# Altium project Omarichet_EPS - Copy.PrjPcb (part 2 of 2)

## Sheet Sheet2.SchDoc
size 350 x 299 mm; SheetNumber: 2; SheetTotal: 3
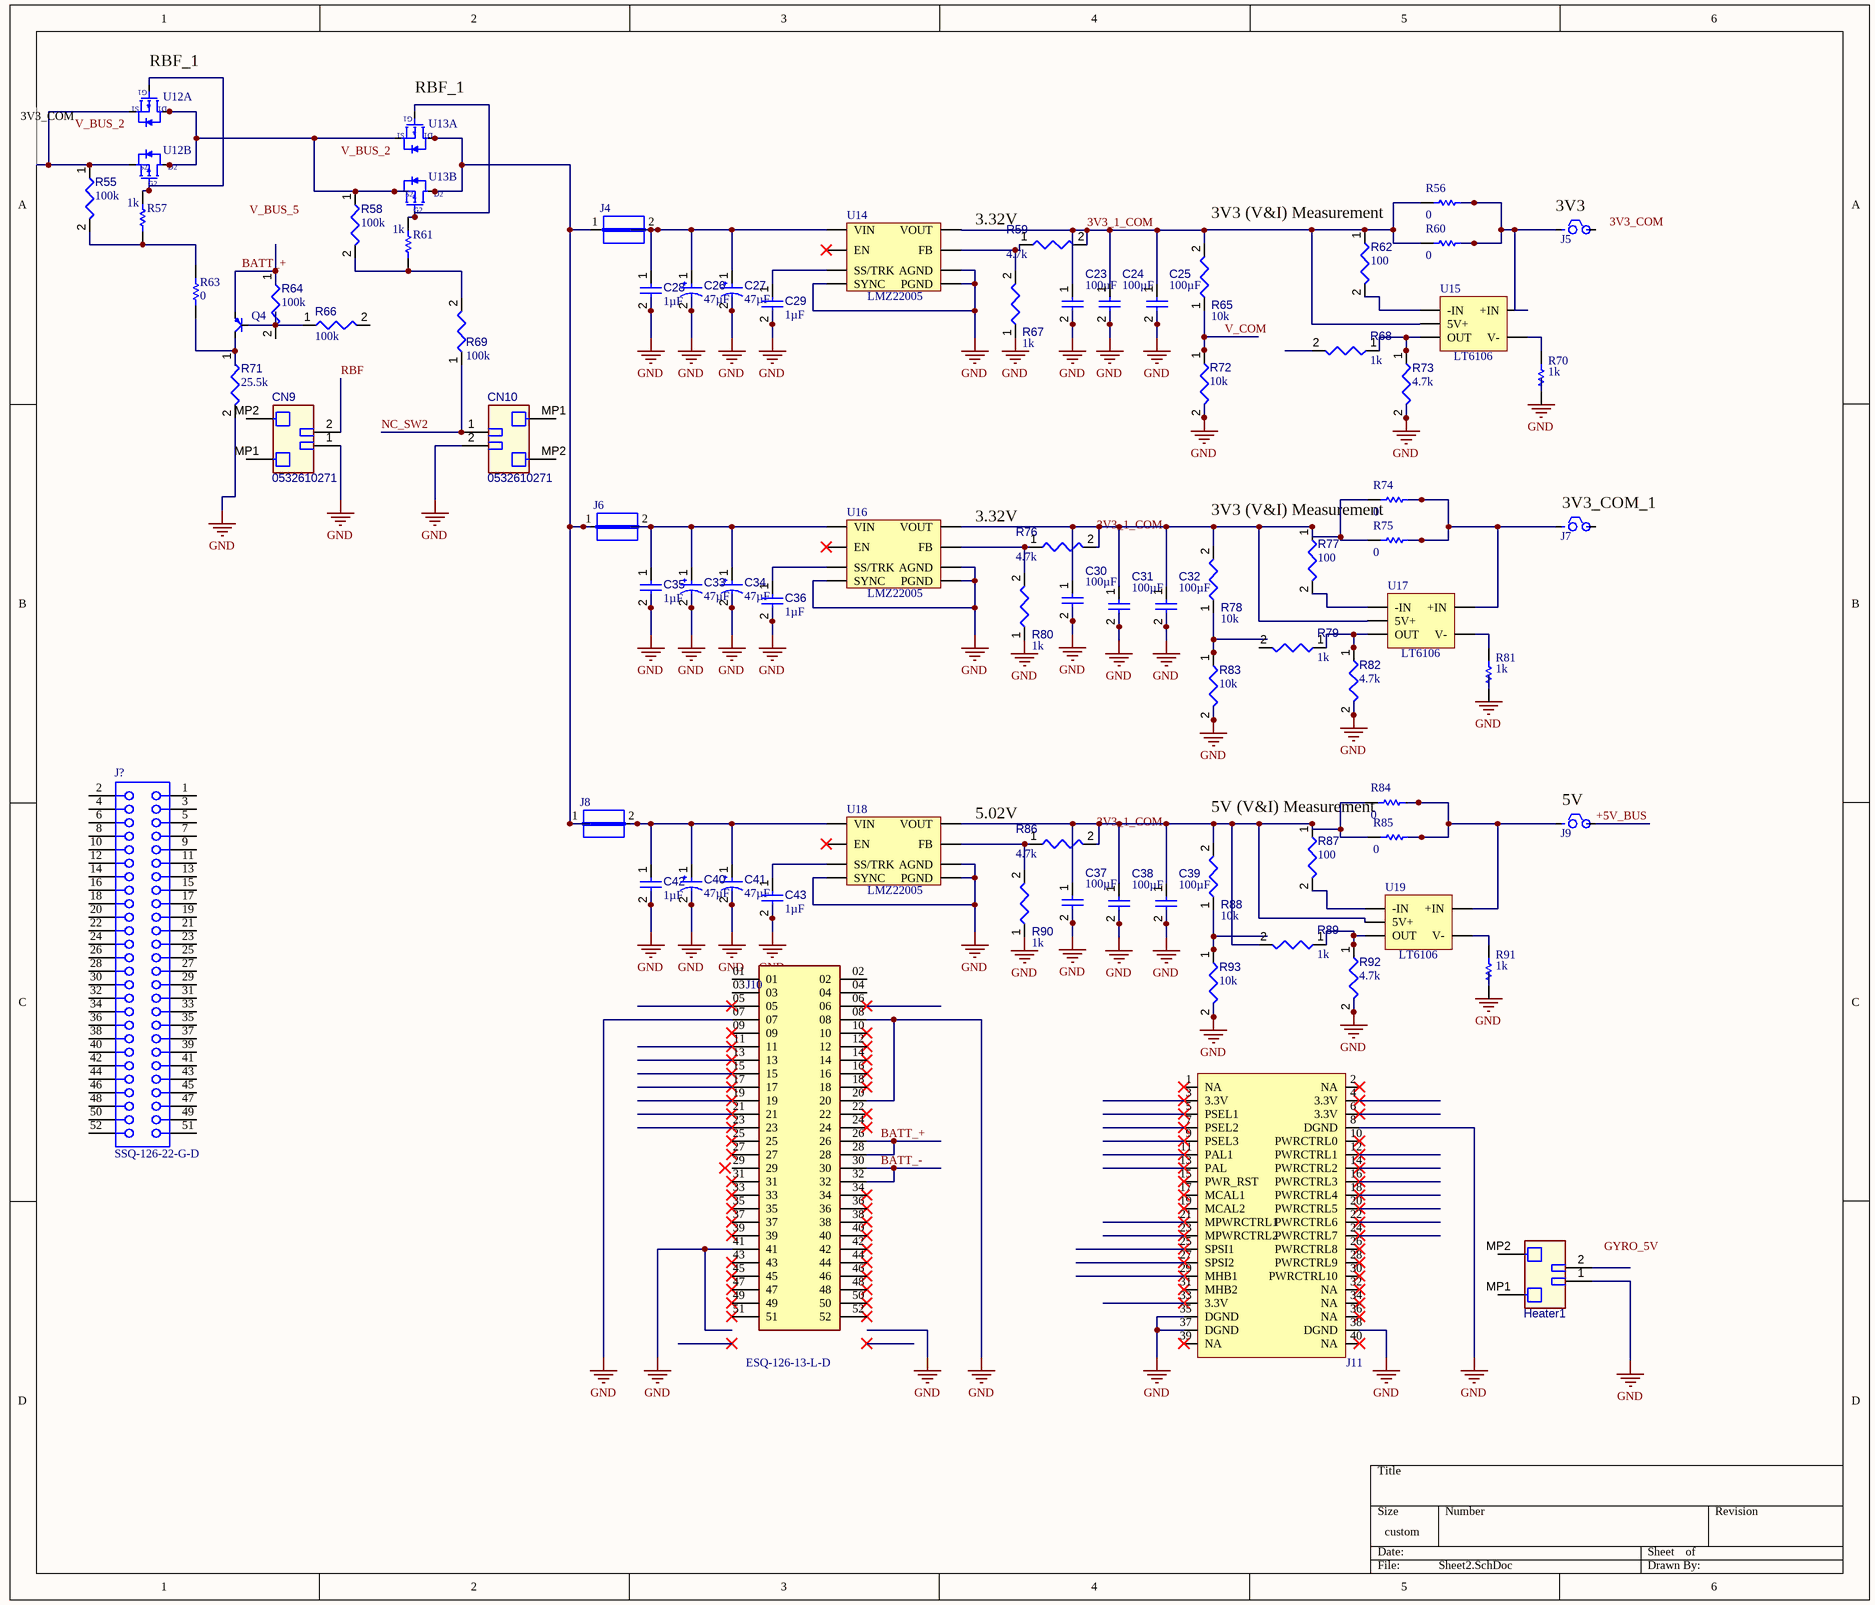
[diagram p1: Sheet2.SchDoc]

### Parts
(Parts that share a designator on the sheet are numbered #1, #2 ... from top to bottom, then left to right.)
C23  value 100µF  [CAPC0805(2012)145_L]  (hidden comment: Capacitor 100µF +/-20% 6.3V 0805)
C24  value 100µF  [CAPC0805(2012)145_L]  (hidden comment: Capacitor 100µF +/-20% 6.3V 0805)
C25  value 100µF  [CAPC3216X190X55LL30T25]  (hidden comment: Capacitor 100 uF +/- 20% 6.3 V 1206)
C26  value 47µF  [CAPPR55-250-1120X630X1220]  (hidden comment: ECA-1HM470)
C27  value 47µF  [CAPPR55-250-1120X630X1220]  (hidden comment: ECA-1HM470)
C28  value 1µF  [CAPC0603(1608)100_L]  (hidden comment: Capacitor 1µF +/-40% 50V 0603)
C29  value 1µF  [CAPC1608X94X35NL15T15]  (hidden comment: Capacitor 1 uF +/- 10% 16 V 0603)
C30  value 100µF  [CAPC0805(2012)145_L]  (hidden comment: Capacitor 100µF +/-20% 6.3V 0805)
C31  value 100µF  [CAPC0805(2012)145_L]  (hidden comment: Capacitor 100µF +/-20% 6.3V 0805)
C32  value 100µF  [CAPC3216X190X55LL30T25]  (hidden comment: Capacitor 100 uF +/- 20% 6.3 V 1206)
C33  value 47µF  [CAPPR55-250-1120X630X1220]  (hidden comment: ECA-1HM470)
C34  value 47µF  [CAPPR55-250-1120X630X1220]  (hidden comment: ECA-1HM470)
C35  value 1µF  [CAPC0603(1608)100_L]  (hidden comment: Capacitor 1µF +/-40% 50V 0603)
C36  value 1µF  [CAPC1608X94X35NL15T15]  (hidden comment: Capacitor 1 uF +/- 10% 16 V 0603)
C37  value 100µF  [CAPC0805(2012)145_L]  (hidden comment: Capacitor 100µF +/-20% 6.3V 0805)
C38  value 100µF  [CAPC0805(2012)145_L]  (hidden comment: Capacitor 100µF +/-20% 6.3V 0805)
C39  value 100µF  [CAPC3216X190X55LL30T25]  (hidden comment: Capacitor 100 uF +/- 20% 6.3 V 1206)
C40  value 47µF  [CAPPR55-250-1120X630X1220]  (hidden comment: ECA-1HM470)
C41  value 47µF  [CAPPR55-250-1120X630X1220]  (hidden comment: ECA-1HM470)
C42  value 1µF  [CAPC0603(1608)100_L]  (hidden comment: Capacitor 1µF +/-40% 50V 0603)
C43  value 1µF  [CAPC1608X94X35NL15T15]  (hidden comment: Capacitor 1 uF +/- 10% 16 V 0603)
CN9  0532610271  [MOLX-532610271_V]
CN10  0532610271  [MOLX-532610271_V]
Heater1  0532610271  [MOLX-532610271_V]  (value not drawn)
J4  JUMPER  [JUMPER]  (value not drawn)
J5  ESW-102-13-L-S  [ESW-102-13-L-S]  (value not drawn)
J6  JUMPER  [JUMPER]  (value not drawn)
J7  ESW-102-13-L-S  [ESW-102-13-L-S]  (value not drawn)
J8  JUMPER  [JUMPER]  (value not drawn)
J9  ESW-102-13-L-S  [ESW-102-13-L-S]  (value not drawn)
J10  ESQ-126-13-L-D  [SAMTEC_ESQ-126-13-L-D]
J11  ESQ-120-13-L-D  [SAMTEC_ESQ-126-13-L-D]  (value not drawn)
J?#1  SSQ-126-22-G-D  [SAMTEC_SSQ-126-X-G-D]
Q4  CMPT404A TR  [CMPT404A TR]  (value not drawn)
R55  value 100k  [RESC1608X55X25ML10T15]  (hidden comment: Resistor 100k +/-1% 0603 100 mW)
R56  value 0  [RESC2013X50X35ML15T15]  (hidden comment: Resistor 0R +/- 1% 0805 125 mW)
R57  value 1k  [RESC3116X70X50ML13T20]  (hidden comment: Resistor 1k +/-1% 1206 250 mW)
R58  value 100k  [RESC1608X55X25ML10T15]  (hidden comment: Resistor 100k +/-1% 0603 100 mW)
R59  value 4.7k  [RESC1005X40X25ML05T05]  (hidden comment: Resistor 4k7 +/-1% 0402 63 mW)
R60  value 0  [RESC2013X50X35ML15T15]  (hidden comment: Resistor 0R +/- 1% 0805 125 mW)
R61  value 1k  [RESC3116X70X50ML13T20]  (hidden comment: Resistor 1k +/-1% 1206 250 mW)
R62  value 100  [RESC0402(1005)_L]  (hidden comment: Resistor 100R +/-1 % 0402 63 mW)
R63  value 0  [RESC1608X55X25ML10T15]  (hidden comment: Resistor 0R +/- 5% 0603 100 mW)
R64  value 100k  [RESC0402(1005)_L]  (hidden comment: Resistor 100K +/-1 % 0402 63 mW)
R65  value 10k  [RESC3216X60X45ML15T20]  (hidden comment: Resistor 10k +/-1% 1206 250 mW)
R66  value 100k  [RESC1005X40X25ML05T05]  (hidden comment: Resistor 1k +/-1% 0402 63 mW)
R67  value 1k  [RESC0402(1005)_L]  (hidden comment: Resistor 1K +/-5 % 0402 63 mW)
R68  value 1k  [RESC0805(2012)_L]  (hidden comment: Resistor 1K +/-5% 0805 125 mW)
R69  value 100k  [RESC1005X40X25ML05T05]  (hidden comment: Resistor 100k +/-1% 0402 100 mW)
R70  value 1k  [RESC1005X40X25ML05T05]  (hidden comment: Resistor 1k +/-1% 0402 100 mW)
R71  value 25.5k  [RESC0402(1005)_L]  (hidden comment: Resistor 25K5 +/-1 % 0402 63 mW)
R72  value 10k  [RESC3216X60X45ML15T20]  (hidden comment: Resistor 10k +/-1% 1206 250 mW)
R73  value 4.7k  [RESC0402(1005)_L]  (hidden comment: Resistor 4K7  +/-1 % 0402 63 mW)
R74  value 0  [RESC2013X50X35ML15T15]  (hidden comment: Resistor 0R +/- 1% 0805 125 mW)
R75  value 0  [RESC2013X50X35ML15T15]  (hidden comment: Resistor 0R +/- 1% 0805 125 mW)
R76  value 4.7k  [RESC1005X40X25ML05T05]  (hidden comment: Resistor 4k7 +/-1% 0402 63 mW)
R77  value 100  [RESC0402(1005)_L]  (hidden comment: Resistor 100R +/-1 % 0402 63 mW)
R78  value 10k  [RESC3216X60X45ML15T20]  (hidden comment: Resistor 10k +/-1% 1206 250 mW)
R79  value 1k  [RESC0805(2012)_L]  (hidden comment: Resistor 1K +/-5% 0805 125 mW)
R80  value 1k  [RESC0402(1005)_L]  (hidden comment: Resistor 1K +/-5 % 0402 63 mW)
R81  value 1k  [RESC1005X40X25ML05T05]  (hidden comment: Resistor 1k +/-1% 0402 100 mW)
R82  value 4.7k  [RESC0402(1005)_L]  (hidden comment: Resistor 4K7  +/-1 % 0402 63 mW)
R83  value 10k  [RESC3216X60X45ML15T20]  (hidden comment: Resistor 10k +/-1% 1206 250 mW)
R84  value 0  [RESC2013X50X35ML15T15]  (hidden comment: Resistor 0R +/- 1% 0805 125 mW)
R85  value 0  [RESC2013X50X35ML15T15]  (hidden comment: Resistor 0R +/- 1% 0805 125 mW)
R86  value 4.7k  [RESC1005X40X25ML05T05]  (hidden comment: Resistor 4k7 +/-1% 0402 63 mW)
R87  value 100  [RESC0402(1005)_L]  (hidden comment: Resistor 100R +/-1 % 0402 63 mW)
R88  value 10k  [RESC3216X60X45ML15T20]  (hidden comment: Resistor 10k +/-1% 1206 250 mW)
R89  value 1k  [RESC0805(2012)_L]  (hidden comment: Resistor 1K +/-5% 0805 125 mW)
R90  value 1k  [RESC0402(1005)_L]  (hidden comment: Resistor 1K +/-5 % 0402 63 mW)
R91  value 1k  [RESC1005X40X25ML05T05]  (hidden comment: Resistor 1k +/-1% 0402 100 mW)
R92  value 4.7k  [RESC0402(1005)_L]  (hidden comment: Resistor 4K7  +/-1 % 0402 63 mW)
R93  value 10k  [RESC3216X60X45ML15T20]  (hidden comment: Resistor 10k +/-1% 1206 250 mW)
U12  IRF7329TRPBF  [Infineon_PG-DSO-8_MFG]  (value not drawn)  (parts A,B of 2)
U13  IRF7329TRPBF  [Infineon_PG-DSO-8_MFG]  (value not drawn)  (parts A,B of 2)
U14  LMZ22005  [TZA07A]
U15  LT6106  [SOT95P280X100-5N_LT6106CS5#TRPBF]
U16  LMZ22005  [TZA07A]
U17  LT6106  [SOT95P280X100-5N_LT6106CS5#TRPBF]
U18  LMZ22005  [TZA07A]
U19  LT6106  [SOT95P280X100-5N_LT6106CS5#TRPBF]

### Nets
GND: C23.2 C24.2 C25.2 C26.2 C27.2 C28.2 C29.2 C30.2 C31.2 C32.2 C33.2 C34.2 C35.2 C36.2 C37.2 C38.2 C39.2 C40.2 C41.2 C42.2 C43.2 CN9.1 CN10.2 Heater1.1 J10.07 J10.08 J10.20 J10.41 J11.8(DGND) J11.35(DGND) J11.37(DGND) J11.38(DGND) R67.1 R71.2 R72.2 R73.2 R80.1 R82.2 R83.2 R90.1 R92.2 R93.2 U14.2(SYNC) U14.4(AGND) U14.8(PGND) U16.2(SYNC) U16.4(AGND) U16.8(PGND) U18.2(SYNC) U18.4(AGND) U18.8(PGND)
3V3_1_COM: C23.1 C24.1 C25.1 R56.1 R59.2 R60.1 R62.1 R65.2 U14.7(VOUT) U15.5(5V+)
+5V_BUS: J9.2
BATT_+: J10.26 J10.28 J10.30 J10.32 Q4.3(C) R64.1  [also labelled BATT_-]
NC_SW2: CN10.1 R69.1
RBF: CN9.2
V_COM: R65.1 R72.1
NetC26_1: C26.1 C27.1 C28.1 J4.2 U14.1(VIN)
NetC29_1: C29.1 U14.6(SS/TRK)
NetC30_1: C30.1 C31.1 C32.1 R74.1 R75.1 R76.2 R77.1 R78.2 U16.7(VOUT) U17.5(5V+)
NetC33_1: C33.1 C34.1 C35.1 J6.2 U16.1(VIN)
NetC36_1: C36.1 U16.6(SS/TRK)
NetC37_1: C37.1 C38.1 C39.1 R84.1 R85.1 R86.2 R87.1 R88.2 R89.2 U18.7(VOUT) U19.5(5V+)
NetC40_1: C40.1 C41.1 C42.1 J8.2 U18.1(VIN)
NetC43_1: C43.1 U18.6(SS/TRK)
NetJ4_1: J4.1 J6.1 J8.1 U13.5(D2) U13.6(D2) U13.7(D1) U13.8(D1)
NetJ5_1: J5.1 R56.2 R60.2 U15.4(+IN)
NetJ7_1: J7.1 R74.2 R75.2 U17.4(+IN)
NetJ9_1: J9.1 R84.2 R85.2 U19.4(+IN)
NetQ4_1: Q4.1(B) R66.1
NetQ4_2: Q4.2(E) R63.1 R71.1
NetR55_1: R55.1 U12.1(S1) U12.3(S2)
NetR55_2: R55.2 R57.1 R63.2
NetR57_2: R57.2 U12.2(G1) U12.4(G2)
NetR58_1: R58.1 U12.5(D2) U12.6(D2) U12.7(D1) U12.8(D1) U13.1(S1) U13.3(S2)
NetR58_2: R58.2 R61.1 R69.2
NetR59_1: R59.1 R67.2 U14.5(FB)
NetR61_2: R61.2 U13.2(G1) U13.4(G2)
NetR62_2: R62.2 U15.3(-IN)
NetR68_1: R68.1 R73.1 U15.1(OUT)
NetR70_1: R70.1 U15.2(V-)
NetR76_1: R76.1 R80.2 U16.5(FB)
NetR77_2: R77.2 U17.3(-IN)
NetR78_1: R78.1 R83.1
NetR79_1: R79.1 R82.1 U17.1(OUT)
NetR81_1: R81.1 U17.2(V-)
NetR86_1: R86.1 R90.2 U18.5(FB)
NetR87_2: R87.2 U19.3(-IN)
NetR88_1: R88.1 R93.1
NetR89_1: R89.1 R92.1 U19.1(OUT)
NetR91_1: R91.1 U19.2(V-)

Not connected (* = marked no-connect by the designer): CN9 MP1 MP2; CN10 MP1 MP2; Heater1 2 MP1 MP2; J5 2; J7 2; J10 01 02 03 04 05* 06* 09* 10* 11* 12* 13* 14* 15* 16* 17* 18* 19* 21* 22* 23* 24* 25* 27* 29 31* 33* 34* 35* 36* 37* 38* 39* 40* 42* 43* 44* 45* 46* 47* 48* 49* 50* 51* 52*; J11 1(NA)* 2(NA)* 3(3.3V)* 4(3.3V)* 5(PSEL1)* 6(3.3V)* 7(PSEL2)* 9(PSEL3)* 10(PWRCTRL0)* 11(PAL1)* 12(PWRCTRL1)* 13(PAL)* 14(PWRCTRL2)* 15(PWR_RST)* 16(PWRCTRL3)* 17(MCAL1)* 18(PWRCTRL4)* 19(MCAL2)* 20(PWRCTRL5)* 21(MPWRCTRL1)* 22(PWRCTRL6)* 23(MPWRCTRL2)* 24(PWRCTRL7)* 25(SPSI1)* 26(PWRCTRL8)* 27(SPSI2)* 28(PWRCTRL9)* 29(MHB1)* 30(PWRCTRL10)* 31(MHB2)* 32(NA)* 33(3.3V)* 34(NA)* 36(NA)* 39(NA)* 40(NA)*; J?#1 1 2 3 4 5 6 7 8 9 10 11 12 13 14 15 16 17 18 19 20 21 22 23 24 25 26 27 28 29 30 31 32 33 34 35 36 37 38 39 40 41 42 43 44 45 46 47 48 49 50 51 52; R64 2; R66 2; R68 2; R70 2; R79 2; R81 2; R91 2; U14 3(EN)*; U16 3(EN)*; U18 3(EN)*

### Notes on the sheet
- (near U12) RBF_1
- (near U13) RBF_1
- 3V3_COM
- 3.32V
- 3V3 (V&I) Measurement
- (near J5) 3V3
- (near R74) 3V3 (V&I) Measurement
- (near J7) 3V3_COM_1
- (near R84) 5V (V&I) Measurement
- (near J9) 5V
- 5.02V
- Labels drawn without touching a wire or pin: 3V3_1_COM, 3V3_COM, GYRO_5V, V_BUS_2, V_BUS_5

### Library data of the parts
C23 C24 C30 C31 C37 C38 = CMP-001-00054-4: Chip Capacitor, 100µF +/-20%, 6.3V, 0805, Thickness 1.45 mm; Tolerance: 10%; Case/Package: 0805; Min Operating Temperature: -55°C; Max Operating Temperature: 85°C; Voltage Rating: 6.3V; Pins: 2; Mounting Technology: SMT
C25 C32 C39 = CMP-001-00019-6: Chip Capacitor, 100 uF, +/- 20%, 6.3 V, 1206 (3216 Metric); Voltage Rating: 6.3V; Capacitor Type: Ceramic; Case/Package: 1206; Min Operating Temperature: -55°C; Max Operating Temperature: 85°C; Tolerance: 20%; RoHS Compliant: True; Pins: 2; Mounting Technology: SM
C26 C27 C33 C34 C40 C41 = CMP-001-00031-7: Aluminum Electrolytic Capacitor, 47 uF, +/-20%, 50 V, -40 to 85 degC, 2-Pin THD, RoHS, Bulk; Manufacturer: Panasonic; Ripple Current: 130mA; Voltage Rating: 50V; Tolerance: 20%; RoHS Compliant: True; Lead Pitch: 2.5mm; Packaging: Bulk; Case/Package: Radial; Diameter: 6.3mm; Datasheet Version: Apr-16; Mounting Technology: TH; Max Operating Temperature: 85°C; Package Quantity: 200; Package Description: 2-Pin Radial Lead, Dia 6.3 mm, Height 12.2 mm; Capacitor Type: Electrolytic; Min Operating Temperature: -40°C; Ripple Current (AC): 130mA; Manufacturer URL: http://www.panasonic.com/; Pins: 2; Datasheet URL: https://industrial.panasonic.com/cdbs/www-data/pdf/RDF0000/DMF0000COL72.pdf; Package Reference: CAPPR55-250-1120X630X1220
C28 C35 C42 = CMP-001-00078-4: Chip Capacitor, 1µF +/-40%, 50V, 0603, Thickness 1 mm; Tolerance: 10%; Case/Package: 0603; Pins: 2; Max Operating Temperature: 85°C; Voltage Rating: 50V; Mounting Technology: SMT; Min Operating Temperature: -55°C
C29 C36 C43 = CMP-001-00003-6: Chip Capacitor, 1 uF, +/- 10%, 16 V, 0603 (1608 Metric); Voltage Rating: 16V; Capacitor Type: Ceramic; Max Operating Temperature: 125°C; Pins: 2; Tolerance: 10%; Min Operating Temperature: -55°C; RoHS Compliant: True; Mounting Technology: SM; Case/Package: 0603
CN9 CN10 Heater1 = CMP-002-00051-3: Header, Pitch 1.25 mm, 1 x 2 Position, Height 3.6 mm, -40 to 85 degC; Connector Type: WiretoBoard; Gender: HDR; Pins: 4
J4 J6 J8 = CMP-009-00061-2: Pins: 2
J5 J7 J9 = ESW-102-13-L-S: CONN SOCKET 2POS 0.1 GOLD PCB; Manufacturer: Samtec; Supplier 1: Digi-Key; Supplier Part Number 1: ESW-102-13-L-S-ND; Manufacturer Part Number: ESW-102-13-L-S; Stock 1: 187; Pricing 1: 1=0.87, 10=0.765, 100=0.66, 500=0.54, 1000=0.48, 5000=0.42, 10000=0.399 (USD); ComponentLink1URL: http://www.farnell.com/datasheets/2607183.pdf?src-supplier=Farnell; ComponentLink1Description: http://www.farnell.com/datasheets/2607183.pdf?src-supplier=Farnell; RoHS Compliant: Yes
J11 = ESQ-120-13-L-D: CONN SOCKET 40POS 0.1 GOLD PCB
J?#1 = SSQ-126-22-G-D: SQ Post Socket, Through-hole, Vertical, -55 to 125 degC, 2.54 mm Pitch, 52-Pin, Female, RoHS; Manufacturer: Samtec; Pitch: 2.54 mm; ComponentLink1Description: Manufacturer URL; ComponentLink2Description: Datasheet; Orientation: Vertical; ComponentLink3Description: Package Specification; ComponentLink3URL: http://www.samtec.com/documents/webfiles/cpdf/SSQ-1XX-XX-XXX-X-XX-XXX-XX-X-MKT.pdf; DatasheetVersion: F-214; ComponentLink1URL: http://www.samtec.com; ComponentLink2URL: http://www.samtec.com/documents/webfiles/pdf/SSQ_TH.PDF; PackageVersion: BD, 6/1987; Temperature Range: -55 to 125 degC; PartNumber: SSQ-126-22-G-D; PackageDescription: Assembly, Socket Strip .025[0.64] SQ Tail; Mounting Technology: Through-hole; RoHS: True; PackageReference: SSQ-126-22-X-D
Q4 = CMPT404A TR: Bipolar Transistors - BJT PNP Silicon Chopper SMT Transistor; Manufacturer: Central Semiconductor; hFE Min: 100; Max Power Dissipation: 350mW; Collector Base Voltage (VCBO): 40V; Collector Emitter Voltage (VCEO): 35V; Emitter Base Voltage (VEBO): 25V; Collector Emitter Saturation Voltage: 200mV; Continuous Collector Current: 150mA; Element Configuration: Single; Supplier 1: Mouser; Supplier Part Number 1: 610-CMPT404A-TR; Manufacturer Part Number: CMPT404A TR; Stock 1: 0; Case/Package: SOT-23; Min Operating Temperature: -65°C; Max Operating Temperature: 150°C; Packaging: Tape and Reel; Package Quantity: 3000; Polarity: PNP; Lead Free: Lead Free; ComponentLink1URL: http://www.mouser.com/ds/2/68/cmpt404a_r1-258738.pdf?src-supplier=Mouser; ComponentLink1Description: http://www.mouser.com/ds/2/68/cmpt404a_r1-258738.pdf?src-supplier=Mouser; ComponentLink2URL: http://www.centralsemi.com/PDFs/products/CMPT404A_R1.PDF?src-supplier=Future+Electronics; ComponentLink2Description: http://www.centralsemi.com/PDFs/products/CMPT404A_R1.PDF?src-supplier=Future+Electronics; ComponentLink3URL: http://datasheet.octopart.com/CMPT404A-TR-Central-Semiconductor-datasheet-527503.pdf?src-supplier=Future+Electronics; ComponentLink3Description: http://datasheet.octopart.com/CMPT404A-TR-Central-Semiconductor-datasheet-527503.pdf?src-supplier=Future+Electronics; ComponentLink4URL: http://datasheet.octopart.com/CMPT404A-TR-Central-Semiconductor-datasheet-13529226.pdf?src-supplier=Future+Electronics; ComponentLink4Description: http://datasheet.octopart.com/CMPT404A-TR-Central-Semiconductor-datasheet-13529226.pdf?src-supplier=Future+Electronics; ComponentLink5Description: New link; ComponentLink5URL: *; ComponentLink6Description: New link; ComponentLink6URL: *
R55 R58 = CMP-009-00023-5: Chip Resistor, 100 KOhm, +/- 1%, 0.1 W, -55 to 155 degC, 0603 (1608 Metric); Voltage Rating: 50V; Power: 100mW; Max Operating Temperature: 155°C; RoHS Compliant: True; Tolerance: 1%; Pins: 2; Case/Package: 0603; Mounting Technology: SM; Min Operating Temperature: -55°C
R56 R60 R74 R75 R84 R85 = CMP-009-00001-5: Chip Resistor, 0 Ohm, +/- 1%, 125 mW, -55 to 155 degC, 0805 (2012 Metric); Voltage Rating: 150V; Power: 125mW; Tolerance: 1%; Mounting Technology: SM; Max Operating Temperature: 155°C; Case/Package: 0805; RoHS Compliant: True; Pins: 2; Min Operating Temperature: -55°C
R57 R61 = CMP-009-00011-5: Chip Resistor, 1 KOhm, +/- 1%, 0.25 W, -55 to 155 degC, 1206 (3216 Metric); Voltage Rating: 200V; Power: 250mW; Max Operating Temperature: 155°C; Mounting Technology: SM; Tolerance: 1%; Case/Package: 1206; RoHS Compliant: True; Min Operating Temperature: -55°C; Pins: 2
R59 R76 R86 = CMP-009-00034-5: Chip Resistor, 4.7 KOhm, +/- 1%, 63 mW, -55 to 155 degC, 0402 (1005 Metric); Voltage Rating: 50V; Power: 63mW; Case/Package: 0402; Min Operating Temperature: -55°C; Max Operating Temperature: 155°C; Tolerance: 1%; Pins: 2; RoHS Compliant: True; Mounting Technology: SM
R62 R77 R87 = CMP-009-00167-3: Chip Resistor, 100 Ohms, +/-1 %, 63 mW, -55 to 155 degC, 0402; Tolerance: 1%; Power: 63mW; Case/Package: 0402; Min Operating Temperature: -55°C; Max Operating Temperature: 155°C; Pins: 2
R63 = CMP-009-00006-5: Chip Resistor, 0 Ohm, 0.1 W, -55 to 155 degC, 0603 (1608 Metric); Power: 100mW; Voltage Rating: 50V; Max Operating Temperature: 155°C; RoHS Compliant: True; Mounting Technology: SM; Case/Package: 0603; Min Operating Temperature: -55°C; Tolerance: 5%; Pins: 2
R64 = CMP-009-00168-3: Chip Resistor, 100 kOhms, +/-1 %, 63 mW, -55 to 155 degC, 0402; Tolerance: 1%; Power: 63mW; Max Operating Temperature: 155°C; Min Operating Temperature: -55°C; Pins: 2; Case/Package: 0402
R65 R72 R78 R83 R88 R93 = CMP-009-00016-5: Chip Resistor, 10 KOhm, +/- 1%, 0.25 W, -55 to 155 degC, 1206 (3216 Metric); Voltage Rating: 200V; Power: 250mW; Case/Package: 1206; Min Operating Temperature: -55°C; Max Operating Temperature: 155°C; Tolerance: 1%; RoHS Compliant: True; Pins: 2; Mounting Technology: SM
R66 = CMP-009-00012-5: Chip Resistor, 1 KOhm, +/- 1%, 63 mW, -55 to 155 degC, 0402 (1005 Metric); Power: 63mW; Max Operating Temperature: 155°C; Min Operating Temperature: -55°C; Case/Package: 0402; Pins: 2; RoHS Compliant: True; Tolerance: 1%; Mounting Technology: SM
R67 R80 R90 = CMP-009-00157-3: Chip Resistor, 1 kOhms, +/-5 %, 63 mW, -55 to 155 degC, 0402; Tolerance: 5%; Power: 63mW; Case/Package: 0402; Min Operating Temperature: -55°C; Max Operating Temperature: 155°C; Pins: 2
R68 R79 R89 = CMP-009-00118-3: Chip Resistor, 1 kOhms, +/-5%, 125 mW, -55 to 155 degC, 0805; Tolerance: 5%; Power: 125mW; Case/Package: 0805; Min Operating Temperature: -55°C; Max Operating Temperature: 155°C; Pins: 2
R69 = CMP-009-00022-5: Chip Resistor, 100 KOhm, +/- 1%, 0.1 W, -55 to 155 degC, 0402 (1005 Metric); Power: 100mW; Voltage Rating: 50V; Max Operating Temperature: 155°C; RoHS Compliant: True; Mounting Technology: SM; Case/Package: 0402; Min Operating Temperature: -55°C; Tolerance: 1%; Pins: 2
R70 R81 R91 = CMP-009-00009-5: Chip Resistor, 1 KOhm, +/- 1%, 0.1 W, -55 to 155 degC, 0402 (1005 Metric); Voltage Rating: 50V; Power: 100mW; Case/Package: 0402; Min Operating Temperature: -55°C; Max Operating Temperature: 155°C; Tolerance: 1%; RoHS Compliant: True; Mounting Technology: SM; Pins: 2
R71 = CMP-009-00171-3: Chip Resistor, 25,5 kOhms, +/-1 %, 63 mW, -55 to 155 degC, 0402; Tolerance: 1%; Power: 63mW; Case/Package: 0402; Min Operating Temperature: -55°C; Max Operating Temperature: 155°C; Pins: 2
R73 R82 R92 = CMP-009-00158-3: Chip Resistor, 4,7 kOhms, +/-1 %, 63 mW, -55 to 155 degC, 0402; Tolerance: 1%; Power: 63mW; Max Operating Temperature: 155°C; Pins: 2; Min Operating Temperature: -55°C; Case/Package: 0402
U12 U13 = IRF7329TRPBF: MOSFET 2P-CH 12V 9.2A 8-SOIC; Manufacturer: International Rectifier; Rise Time: 8.6ns; Fall Time: 260ns; Turn-On Delay Time: 10ns; Turn-Off Delay Time: 340ns; Gate to Source Voltage (Vgs): 8V; Rds On Max: 17mR; Input Capacitance: 3.45nF; Number of Elements: 2; Max Power Dissipation: 2W; Element Configuration: Dual; Drain to Source Breakdown Voltage: -12V; Current Rating: -9.2A; Supplier 1: Digi-Key; Supplier Part Number 1: IRF7329PBFCT-ND; Manufacturer Part Number: IRF7329TRPBF; Stock 1: 21693; Pricing 1: 1=1.23, 10=1.007, 25=0.988, 100=0.7831, 500=0.6638, 1000=0.5407 (USD); Mount: Surface Mount; Case/Package: SOIC; Number of Pins: 8; Min Operating Temperature: -55°C; Max Operating Temperature: 150°C; Continuous Drain Current (ID): 9.2A; Package Quantity: 1; Packaging: Tape and Reel; Drain to Source Voltage (Vdss): 12V; Drain to Source Resistance: 17mR; Power Dissipation: 2W; Voltage Rating (DC): -12V; Series: HEXFET®; Length: 5mm; Width: 4mm; Height: 1.5mm; Radiation Hardening: No; Lead Free: Lead Free; RoHS Compliant: Yes; ComponentLink1URL: https://www.infineon.com/dgdl/irf7329pbf.pdf?fileId=5546d462533600a4015355f617841b55&src-supplier=Digi-Key; ComponentLink1Description: https://www.infineon.com/dgdl/irf7329pbf.pdf?fileId=5546d462533600a4015355f617841b55&src-supplier=Digi-Key; ComponentLink2URL: https://www.verical.com/server-webapp/html/getDatasheet?partID=357970&src-supplier=Verical; ComponentLink2Description: https://www.verical.com/server-webapp/html/getDatasheet?partID=357970&src-supplier=Verical; ComponentLink3URL: http://datasheet.iiic.cc/international_rectifier/IRF7329TRPBF.pdf?src-supplier=IIIC; ComponentLink3Description: http://datasheet.iiic.cc/international_rectifier/IRF7329TRPBF.pdf?src-supplier=IIIC
U14 U16 U18 = LMZ22005TZX/NOPB: DC DC CONVERTER 0.8-6V; Manufacturer: TI National Semiconductor; Output Current: 5A; Max Input Voltage: 20V; Output Voltage: 6V; Number of Outputs: 1; Output Power: 30W; Efficiency: 92%; Switching Frequency: 950kHz; Supplier 1: Digi-Key; Supplier Part Number 1: 296-43603-1-ND; Manufacturer Part Number: LMZ22005TZX/NOPB; Stock 1: 2457; Pricing 1: 1=9.19, 5=9.124, 10=9.055, 25=8.9156, 50=8.637, 100=7.8012, 250=7.6619 (USD); Mount: Surface Mount; Number of Pins: 7; Contact Plating: Tin,Matte; Min Operating Temperature: -40°C; Max Operating Temperature: 85°C; Min Input Voltage: 6V; Packaging: Tape and Reel; Package Quantity: 500; Voltage - Output 1: 6V; Max Power Dissipation: 30W; Features: UVLO; Length: 0.4inch; Height: 0.18inch; Width: 0.54inch; Lead Free: Lead Free; ComponentLink1URL: http://www.ti.com/lit/ds/symlink/lmz22005.pdf?src-supplier=Digi-Key; ComponentLink1Description: http://www.ti.com/lit/ds/symlink/lmz22005.pdf?src-supplier=Digi-Key
U15 U17 U19 = LT6106HS5#TRPBF: IC OPAMP CURR SENSE TSOT23-5; Manufacturer: Linear Technology; Manufacturer Part Number: LT6106HS5#TRMPBF; Amplifier Type: Current Sense; Current - Supply: 70µA; Voltage - Supply, Single/Dual (±): 2.7 V ~ 36 V; Supplier 1: Digi-Key; RoHS: RoHS Compliant; Category: Integrated Circuits (ICs); Stock 1: 7462; Pricing 1: 1=2.3, 25=2.0504, 100=1.3586, 250=1.24544 (USD); Packaging: Cut Tape (CT); Part Status: Active; Output Type: -; Slew Rate: -; Operating Temperature: -40°C ~ 125°C; Mounting Type: Surface Mount; Package / Case: SOT-23-5 Thin, TSOT-23-5; Supplier Device Package: TSOT-23-5; Base Part Number: LT6106; ComponentLink1URL: http://www.linear.com/docs/24992; ComponentLink1Description: http://www.linear.com/docs/24992; Supplier Part Number 1: LT6106HS5#TRMPBFCT-ND
J10 = ESQ-126-13-L-D: Price: None; MP: ESQ-126-13-L-D; Package: None; Availability: Unavailable; Value: *

## Sheet Sheet3.SchDoc
size 300 x 250 mm; SheetNumber: 3; SheetTotal: 3
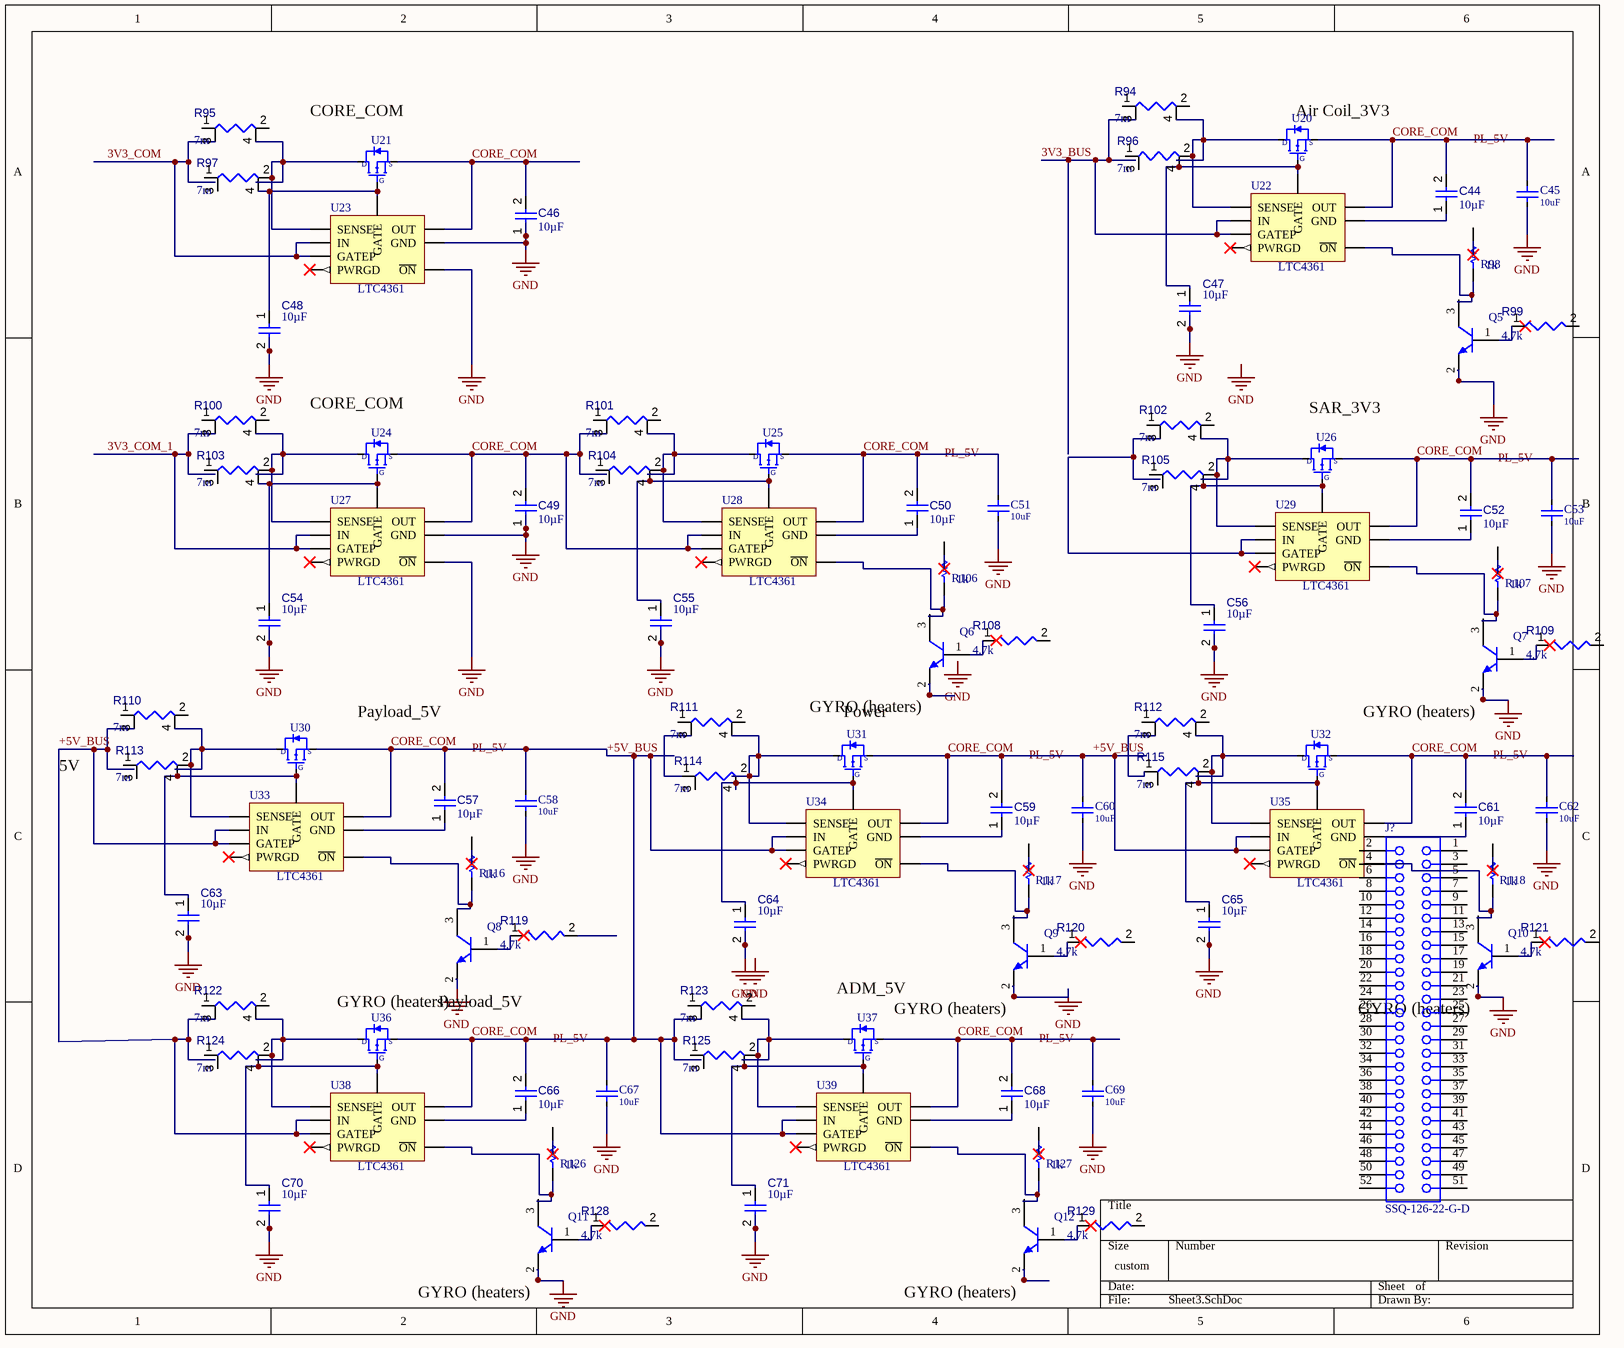
[diagram p2: Sheet3.SchDoc]

### Parts
(Parts that share a designator on the sheet are numbered #1, #2 ... from top to bottom, then left to right.)
C44  value 10µF  [CAPC0805(2012)145_L]  (hidden comment: Capacitor 10µF +/-20% 25V 0805)
C45  value 10uF  [CL21B106KOQNNNE]  (hidden comment: CL21B106KOQNNNE)
C46  value 10µF  [CAPC0805(2012)145_L]  (hidden comment: Capacitor 10µF +/-20% 25V 0805)
C47  value 10µF  [CAPC0805(2012)145_L]  (hidden comment: Capacitor 10µF +/-20% 25V 0805)
C48  value 10µF  [CAPC0805(2012)145_L]  (hidden comment: Capacitor 10µF +/-20% 25V 0805)
C49  value 10µF  [CAPC0805(2012)145_L]  (hidden comment: Capacitor 10µF +/-20% 25V 0805)
C50  value 10µF  [CAPC0805(2012)145_L]  (hidden comment: Capacitor 10µF +/-20% 25V 0805)
C51  value 10uF  [CL21B106KOQNNNE]  (hidden comment: CL21B106KOQNNNE)
C52  value 10µF  [CAPC0805(2012)145_L]  (hidden comment: Capacitor 10µF +/-20% 25V 0805)
C53  value 10uF  [CL21B106KOQNNNE]  (hidden comment: CL21B106KOQNNNE)
C54  value 10µF  [CAPC0805(2012)145_L]  (hidden comment: Capacitor 10µF +/-20% 25V 0805)
C55  value 10µF  [CAPC0805(2012)145_L]  (hidden comment: Capacitor 10µF +/-20% 25V 0805)
C56  value 10µF  [CAPC0805(2012)145_L]  (hidden comment: Capacitor 10µF +/-20% 25V 0805)
C57  value 10µF  [CAPC0805(2012)145_L]  (hidden comment: Capacitor 10µF +/-20% 25V 0805)
C58  value 10uF  [CL21B106KOQNNNE]  (hidden comment: CL21B106KOQNNNE)
C59  value 10µF  [CAPC0805(2012)145_L]  (hidden comment: Capacitor 10µF +/-20% 25V 0805)
C60  value 10uF  [CL21B106KOQNNNE]  (hidden comment: CL21B106KOQNNNE)
C61  value 10µF  [CAPC0805(2012)145_L]  (hidden comment: Capacitor 10µF +/-20% 25V 0805)
C62  value 10uF  [CL21B106KOQNNNE]  (hidden comment: CL21B106KOQNNNE)
C63  value 10µF  [CAPC0805(2012)145_L]  (hidden comment: Capacitor 10µF +/-20% 25V 0805)
C64  value 10µF  [CAPC0805(2012)145_L]  (hidden comment: Capacitor 10µF +/-20% 25V 0805)
C65  value 10µF  [CAPC0805(2012)145_L]  (hidden comment: Capacitor 10µF +/-20% 25V 0805)
C66  value 10µF  [CAPC0805(2012)145_L]  (hidden comment: Capacitor 10µF +/-20% 25V 0805)
C67  value 10uF  [CL21B106KOQNNNE]  (hidden comment: CL21B106KOQNNNE)
C68  value 10µF  [CAPC0805(2012)145_L]  (hidden comment: Capacitor 10µF +/-20% 25V 0805)
C69  value 10uF  [CL21B106KOQNNNE]  (hidden comment: CL21B106KOQNNNE)
C70  value 10µF  [CAPC0805(2012)145_L]  (hidden comment: Capacitor 10µF +/-20% 25V 0805)
C71  value 10µF  [CAPC0805(2012)145_L]  (hidden comment: Capacitor 10µF +/-20% 25V 0805)
J?#2  SSQ-126-22-G-D  [SAMTEC_SSQ-126-X-G-D]
Q5  MMBT3904  [FAIR-SOT23-3_V]  (value not drawn)
Q6  MMBT3904  [FAIR-SOT23-3_V]  (value not drawn)
Q7  MMBT3904  [FAIR-SOT23-3_V]  (value not drawn)
Q8  MMBT3904  [FAIR-SOT23-3_V]  (value not drawn)
Q9  MMBT3904  [FAIR-SOT23-3_V]  (value not drawn)
Q10  MMBT3904  [FAIR-SOT23-3_V]  (value not drawn)
Q11  MMBT3904  [FAIR-SOT23-3_V]  (value not drawn)
Q12  MMBT3904  [FAIR-SOT23-3_V]  (value not drawn)
R94  value 7m  [SUSUMU-3216T4A]  (hidden comment: Resistor 7mR +/-1% 1206 63 mW)
R95  value 7m  [SUSUMU-3216T4A]  (hidden comment: Resistor 7mR +/-1% 1206 63 mW)
R96  value 7m  [SUSUMU-3216T4A]  (hidden comment: Resistor 7mR +/-1% 1206 63 mW)
R97  value 7m  [SUSUMU-3216T4A]  (hidden comment: Resistor 7mR +/-1% 1206 63 mW)
R98  value 1k  [RESC1005X40X25ML05T05]  (hidden comment: Resistor 1k +/-1% 0402 100 mW)
R99  value 4.7k  [RESC2013X70X40ML20T20]  (hidden comment: Resistor 4k7 +/-1% 0805 125 mW)
R100  value 7m  [SUSUMU-3216T4A]  (hidden comment: Resistor 7mR +/-1% 1206 63 mW)
R101  value 7m  [SUSUMU-3216T4A]  (hidden comment: Resistor 7mR +/-1% 1206 63 mW)
R102  value 7m  [SUSUMU-3216T4A]  (hidden comment: Resistor 7mR +/-1% 1206 63 mW)
R103  value 7m  [SUSUMU-3216T4A]  (hidden comment: Resistor 7mR +/-1% 1206 63 mW)
R104  value 7m  [SUSUMU-3216T4A]  (hidden comment: Resistor 7mR +/-1% 1206 63 mW)
R105  value 7m  [SUSUMU-3216T4A]  (hidden comment: Resistor 7mR +/-1% 1206 63 mW)
R106  value 1k  [RESC1005X40X25ML05T05]  (hidden comment: Resistor 1k +/-1% 0402 100 mW)
R107  value 1k  [RESC1005X40X25ML05T05]  (hidden comment: Resistor 1k +/-1% 0402 100 mW)
R108  value 4.7k  [RESC2013X70X40ML20T20]  (hidden comment: Resistor 4k7 +/-1% 0805 125 mW)
R109  value 4.7k  [RESC2013X70X40ML20T20]  (hidden comment: Resistor 4k7 +/-1% 0805 125 mW)
R110  value 7m  [SUSUMU-3216T4A]  (hidden comment: Resistor 7mR +/-1% 1206 63 mW)
R111  value 7m  [SUSUMU-3216T4A]  (hidden comment: Resistor 7mR +/-1% 1206 63 mW)
R112  value 7m  [SUSUMU-3216T4A]  (hidden comment: Resistor 7mR +/-1% 1206 63 mW)
R113  value 7m  [SUSUMU-3216T4A]  (hidden comment: Resistor 7mR +/-1% 1206 63 mW)
R114  value 7m  [SUSUMU-3216T4A]  (hidden comment: Resistor 7mR +/-1% 1206 63 mW)
R115  value 7m  [SUSUMU-3216T4A]  (hidden comment: Resistor 7mR +/-1% 1206 63 mW)
R116  value 1k  [RESC1005X40X25ML05T05]  (hidden comment: Resistor 1k +/-1% 0402 100 mW)
R117  value 1k  [RESC1005X40X25ML05T05]  (hidden comment: Resistor 1k +/-1% 0402 100 mW)
R118  value 1k  [RESC1005X40X25ML05T05]  (hidden comment: Resistor 1k +/-1% 0402 100 mW)
R119  value 4.7k  [RESC2013X70X40ML20T20]  (hidden comment: Resistor 4k7 +/-1% 0805 125 mW)
R120  value 4.7k  [RESC2013X70X40ML20T20]  (hidden comment: Resistor 4k7 +/-1% 0805 125 mW)
R121  value 4.7k  [RESC2013X70X40ML20T20]  (hidden comment: Resistor 4k7 +/-1% 0805 125 mW)
R122  value 7m  [SUSUMU-3216T4A]  (hidden comment: Resistor 7mR +/-1% 1206 63 mW)
R123  value 7m  [SUSUMU-3216T4A]  (hidden comment: Resistor 7mR +/-1% 1206 63 mW)
R124  value 7m  [SUSUMU-3216T4A]  (hidden comment: Resistor 7mR +/-1% 1206 63 mW)
R125  value 7m  [SUSUMU-3216T4A]  (hidden comment: Resistor 7mR +/-1% 1206 63 mW)
R126  value 1k  [RESC1005X40X25ML05T05]  (hidden comment: Resistor 1k +/-1% 0402 100 mW)
R127  value 1k  [RESC1005X40X25ML05T05]  (hidden comment: Resistor 1k +/-1% 0402 100 mW)
R128  value 4.7k  [RESC2013X70X40ML20T20]  (hidden comment: Resistor 4k7 +/-1% 0805 125 mW)
R129  value 4.7k  [RESC2013X70X40ML20T20]  (hidden comment: Resistor 4k7 +/-1% 0805 125 mW)
U20  IRFML8244TRPBF  [SOT23_527AG_ONS]  (value not drawn)
U21  IRFML8244TRPBF  [SOT23_527AG_ONS]  (value not drawn)
U22  LTC4361  [DFN-8_DC_LIT]
U23  LTC4361  [DFN-8_DC_LIT]
U24  IRFML8244TRPBF  [SOT23_527AG_ONS]  (value not drawn)
U25  IRFML8244TRPBF  [SOT23_527AG_ONS]  (value not drawn)
U26  IRFML8244TRPBF  [SOT23_527AG_ONS]  (value not drawn)
U27  LTC4361  [DFN-8_DC_LIT]
U28  LTC4361  [DFN-8_DC_LIT]
U29  LTC4361  [DFN-8_DC_LIT]
U30  IRFML8244TRPBF  [SOT23_527AG_ONS]  (value not drawn)
U31  IRFML8244TRPBF  [SOT23_527AG_ONS]  (value not drawn)
U32  IRFML8244TRPBF  [SOT23_527AG_ONS]  (value not drawn)
U33  LTC4361  [DFN-8_DC_LIT]
U34  LTC4361  [DFN-8_DC_LIT]
U35  LTC4361  [DFN-8_DC_LIT]
U36  IRFML8244TRPBF  [SOT23_527AG_ONS]  (value not drawn)
U37  IRFML8244TRPBF  [SOT23_527AG_ONS]  (value not drawn)
U38  LTC4361  [DFN-8_DC_LIT]
U39  LTC4361  [DFN-8_DC_LIT]

### Nets
GND: C45.1 C46.1 C47.2 C48.2 C49.1 C51.1 C53.1 C54.2 C55.2 C56.2 C58.1 C60.1 C62.1 C63.2 C64.2 C65.2 C67.1 C69.1 C70.2 C71.2 Q5.2(E) Q7.2(E) Q9.2(E) Q10.2(E) Q11.2(E) U23.1(~{ON}) U23.4(GND) U27.1(~{ON}) U27.4(GND)
3V3_BUS: R94.3(E1) U22.3(GATEP) U22.5(IN)
3V3_COM: R95.3(E1) U23.3(GATEP) U23.5(IN)
3V3_COM_1: R100.3(E1) U27.3(GATEP) U27.5(IN)
+5V_BUS: C44.2 C45.2 C46.2 C49.2 C50.2 C51.2 C52.2 C53.2 C57.2 C58.2 C59.2 C60.2 C61.2 C62.2 C66.2 C67.2 C68.2 C69.2 R101.3(E1) R110.3(E1) R122.3(E1) R123.3(E1) U20.2(S) U21.2(S) U22.2(OUT) U23.2(OUT) U24.2(S) U25.2(S) U26.2(S) U27.2(OUT) U28.2(OUT) U28.3(GATEP) U28.5(IN) U29.2(OUT) U30.2(S) U31.2(S) U32.2(S) U33.2(OUT) U33.3(GATEP) U33.5(IN) U34.2(OUT) U34.3(GATEP) U34.5(IN) U35.2(OUT) U35.3(GATEP) U35.5(IN) U36.2(S) U37.2(S) U38.2(OUT) U38.3(GATEP) U38.5(IN) U39.2(OUT) U39.3(GATEP) U39.5(IN)  [also labelled CORE_COM]
NetC44_1: C44.1 U22.4(GND)
NetC47_1: C47.1 R96.4(E2) U20.1(G) U22.7(GATE)
NetC48_1: C48.1 R97.4(E2) U21.1(G) U23.7(GATE)
NetC50_1: C50.1 U28.4(GND)
NetC52_1: C52.1 U29.4(GND)
NetC54_1: C54.1 R103.4(E2) U24.1(G) U27.7(GATE)
NetC55_1: C55.1 R104.4(E2) U25.1(G) U28.7(GATE)
NetC56_1: C56.1 R105.4(E2) U26.1(G) U29.7(GATE)
NetC57_1: C57.1 U33.4(GND)
NetC59_1: C59.1 U34.4(GND)
NetC61_1: C61.1 U35.4(GND)
NetC63_1: C63.1 R113.4(E2) U30.1(G) U33.7(GATE)
NetC64_1: C64.1 R114.4(E2) U31.1(G) U34.7(GATE)
NetC65_1: C65.1 R115.4(E2) U32.1(G) U35.7(GATE)
NetC66_1: C66.1 U38.4(GND)
NetC68_1: C68.1 U39.4(GND)
NetC70_1: C70.1 R124.4(E2) U36.1(G) U38.7(GATE)
NetC71_1: C71.1 R125.4(E2) U37.1(G) U39.7(GATE)
NetQ5_1: Q5.1(B) R99.1
NetQ6_1: Q6.1(B) R108.1
NetQ7_1: Q7.1(B) R109.1
NetQ8_1: Q8.1(B) R119.1
NetQ8_3: Q8.3(C) R116.1 U33.1(~{ON})
NetQ9_1: Q9.1(B) R120.1
NetQ10_1: Q10.1(B) R121.1
NetQ11_1: Q11.1(B) R128.1
NetQ12_1: Q12.1(B) R129.1
NetR94_4: R94.4(E2) R96.2(I2) U20.3(D) U22.6(SENSE)
NetR95_4: R95.4(E2) R97.2(I2) U21.3(D) U23.6(SENSE)
NetR98_1: R98.1 U22.1(~{ON})
NetR100_4: R100.4(E2) R103.2(I2) U24.3(D) U27.6(SENSE)
NetR101_4: R101.4(E2) R104.2(I2) U25.3(D) U28.6(SENSE)
NetR102_3: R102.3(E1) U29.3(GATEP) U29.5(IN)
NetR102_4: R102.4(E2) R105.2(I2) U26.3(D) U29.6(SENSE)
NetR106_1: R106.1 U28.1(~{ON})
NetR107_1: R107.1 U29.1(~{ON})
NetR110_4: R110.4(E2) R113.2(I2) U30.3(D) U33.6(SENSE)
NetR111_3: R111.3(E1) R114.1(I1)
NetR111_4: R111.4(E2) R114.2(I2) U31.3(D) U34.6(SENSE)
NetR112_3: R112.3(E1) R115.1(I1)
NetR112_4: R112.4(E2) R115.2(I2) U32.3(D) U35.6(SENSE)
NetR117_1: R117.1 U34.1(~{ON})
NetR118_1: R118.1 U35.1(~{ON})
NetR122_4: R122.4(E2) R124.2(I2) U36.3(D) U38.6(SENSE)
NetR123_4: R123.4(E2) R125.2(I2) U37.3(D) U39.6(SENSE)
NetR126_1: R126.1 U38.1(~{ON})
NetR127_1: R127.1 U39.1(~{ON})

Not connected (* = marked no-connect by the designer): J?#2 1 2 3 4 5 6 7 8 9 10 11 12 13 14 15 16 17 18 19 20 21 22 23 24 25 26 27 28 29 30 31 32 33 34 35 36 37 38 39 40 41 42 43 44 45 46 47 48 49 50 51 52; Q5 3(C); Q6 2(E) 3(C); Q7 3(C); Q8 2(E); Q9 3(C); Q10 3(C); Q11 3(C); Q12 2(E) 3(C); R94 1(I1) 2(I2); R95 1(I1) 2(I2); R96 1(I1) 3(E1); R97 1(I1) 3(E1); R98 2; R99 2; R100 1(I1) 2(I2); R101 1(I1) 2(I2); R102 1(I1) 2(I2); R103 1(I1) 3(E1); R104 1(I1) 3(E1); R105 1(I1) 3(E1); R106 2; R107 2; R108 2; R109 2; R110 1(I1) 2(I2); R111 1(I1) 2(I2); R112 1(I1) 2(I2); R113 1(I1) 3(E1); R114 3(E1); R115 3(E1); R116 2; R117 2; R118 2; R119 2; R120 2; R121 2; R122 1(I1) 2(I2); R123 1(I1) 2(I2); R124 1(I1) 3(E1); R125 1(I1) 3(E1); R126 2; R127 2; R128 2; R129 2; U22 8(PWRGD)*; U23 8(PWRGD)*; U27 8(PWRGD)*; U28 8(PWRGD)*; U29 8(PWRGD)*; U33 8(PWRGD)*; U34 8(PWRGD)*; U35 8(PWRGD)*; U38 8(PWRGD)*; U39 8(PWRGD)*

### Notes on the sheet
- CORE_COM
- (near U20) Air Coil_3V3
- (near U26) SAR_3V3
- Payload_5V
- GYRO (heaters)
- (near U31) Power
- 5V
- (near Q8) Payload_5V
- (near U37) ADM_5V
- (near J?#2) GYRO (heaters)
- (near Q11) GYRO (heaters)
- (near Q12) GYRO (heaters)
- Labels drawn without touching a wire or pin: GND, PL_5V

### Library data of the parts
C44 C46-C50 C52 C54-C57 C59 C61 C63-C66 C68 C70 C71 = CMP-001-00079-4: Chip Capacitor, 10µF +/-20%, 25V, 0805, Thickness 1.45 mm; Tolerance: 10%; Max Operating Temperature: 85°C; Case/Package: 0805; Voltage Rating: 25V; Min Operating Temperature: -55°C; Mounting Technology: SMT; Pins: 2
C45 C51 C53 C58 C60 C62 C67 C69 = CL21B106KOQNNNE: CAP CER 10UF 16V X7R 0805; Manufacturer: Samsung Electro-Mechanics; Tolerance: ±10%; Notification: Current market demand for these product types have resulted in fluctuating and extending lead times. Lead times may differ.; Supplier 1: Digi-Key; Manufacturer Part Number: CL21B106KOQNNNE; RoHS: RoHS Compliant; Category: Capacitors; Stock 1: 25; Pricing 1: 1=0.34, 10=0.232, 100=0.1313, 500=0.0927, 1000=0.08111 (USD); Packaging: Cut Tape (CT); Part Status: Active; Voltage - Rated: 16V; Temperature Coefficient: X7R; Operating Temperature: -55°C ~ 125°C; Features: -; Ratings: -; Applications: General Purpose; Mounting Type: Surface Mount, MLCC; Package / Case: 0805 (2012 Metric); Size / Dimension: 0.079" L x 0.049" W (2.00mm x 1.25mm); Height - Seated (Max): -; Thickness (Max): 0.055" (1.40mm); Lead Spacing: -; Lead Style: -; ComponentLink1URL: http://www.samsungsem.com/kr/support/product-search/mlcc/CL21B106KOQNNNE.jsp; ComponentLink1Description: http://www.samsungsem.com/kr/support/product-search/mlcc/CL21B106KOQNNNE.jsp; Supplier Part Number 1: 1276-2872-1-ND
J?#2 = SSQ-126-22-G-D: as J?#1 on sheet Sheet2; ComponentLink1Description: Manufacturer URL; ComponentLink2Description: Datasheet; Orientation: Vertical; ComponentLink3Description: Package Specification; ComponentLink3URL: http://www.samtec.com/documents/webfiles/cpdf/SSQ-1XX-XX-XXX-X-XX-XXX-XX-X-MKT.pdf; DatasheetVersion: F-214; ComponentLink1URL: http://www.samtec.com; ComponentLink2URL: http://www.samtec.com/documents/webfiles/pdf/SSQ_TH.PDF; PackageVersion: BD, 6/1987; Temperature Range: -55 to 125 degC; PartNumber: SSQ-126-22-G-D; PackageDescription: Assembly, Socket Strip .025[0.64] SQ Tail; Mounting Technology: Through-hole; RoHS: True; PackageReference: SSQ-126-22-X-D
Q5-Q12 = CMP-014-00026-2: NPN General Purpose Amplifier, 40 V, 0.2 A, -55 to 150 degC, 3-Pin SOT23, RoHS, Tape and Reel; Manufacturer: Fairchild Semiconductor; Package Version: Rev. 12, 03/2016; Elements: 1; Power: 625mW; hFE Min: 100; Vce Max: 300mV; Frequency: 300MHz; Packaging: TapeandReel; Pins: 3; Package Description: 3-Pin Small Outline Transistor, Body 2.92 x 1.325 mm, Pitch 0.95 mm; RoHS Compliant: True; Package Quantity: 3000; Manufacturer URL: https://www.fairchildsemi.com/; Min Operating Temperature: -55°C; Max Operating Temperature: 150°C; Mounting Technology: SM; Case/Package: TO-236-3; Package Reference: SOT23-3; Datasheet Version: Rev. 1.1.0, 10/2014; Datasheet URL: https://www.fairchildsemi.com/datasheets/MM/MMBT3904.pdf; Package URL: http://www.fairchildsemi.com/dwg/MA/MA03D.pdf
R94-R97 R100-R105 R110-R115 R122-R125 = CMP-009-00119-3: Chip Resistor, 0,007 Ohms, +/-1%, 63 mW, -55 to 155 degC, 1206; Tolerance: 1%; Max Operating Temperature: 155°C; Min Operating Temperature: -55°C; Pins: 4; Case/Package: 1206
R98 R106 R107 R116-R118 R126 R127 = CMP-009-00009-5: as R70 on sheet Sheet2; Case/Package: 0402; Min Operating Temperature: -55°C; Max Operating Temperature: 155°C; Tolerance: 1%; RoHS Compliant: True; Mounting Technology: SM; Pins: 2
R99 R108 R109 R119-R121 R128 R129 = CMP-009-00032-5: Chip Resistor, 4.7 KOhm, +/- 1%, 0.125 W, -55 to 155 degC, 0805 (2012 Metric); Power: 125mW; Voltage Rating: 150V; Tolerance: 1%; Max Operating Temperature: 155°C; Min Operating Temperature: -55°C; Case/Package: 0805; RoHS Compliant: True; Pins: 2; Mounting Technology: SM
U20 U21 U24-U26 U30-U32 U36 U37 = IRFML8244TRPBF: MOSFET N-CH 25V 5.8A SOT23; Manufacturer: International Rectifier; Rise Time: 2.1ns; Gate to Source Voltage (Vgs): 20V; Turn-On Delay Time: 2.7ns; Turn-Off Delay Time: 9ns; Fall Time: 2.9ns; Nominal Vgs: 1.7V; Rds On Max: 24mR; Input Capacitance: 430pF; Max Power Dissipation: 1.25W; Number of Elements: 1; Drain to Source Resistance: 41mR; Element Configuration: Single; Recovery Time: 17ns; Supplier 1: Digi-Key; Supplier Part Number 1: IRFML8244TRPBFCT-ND; Manufacturer Part Number: IRFML8244TRPBF; Stock 1: 12011; Pricing 1: 1=0.47, 10=0.357, 25=0.3216, 100=0.1697, 500=0.1503, 1000=0.117 (USD); Mount: Surface Mount; Case/Package: SOT-23; Number of Pins: 3; Min Operating Temperature: -55°C; Max Operating Temperature: 150°C; Continuous Drain Current (ID): 5.8A; Packaging: Tape and Reel; Package Quantity: 1; Drain to Source Breakdown Voltage: 25V; Power Dissipation: 1.25W; Drain to Source Voltage (Vdss): 25V; Threshold Voltage: 1.7V; On-State Resistance: 41MR; Length: 3.04mm; Height: 1.02mm; Width: 1.4mm; Radiation Hardening: No; REACH SVHC: No SVHC; Lead Free: Lead Free; ComponentLink1URL: http://farnell.com//datasheets/1911843.pdf?src-supplier=Farnell; ComponentLink1Description: http://farnell.com//datasheets/1911843.pdf?src-supplier=Farnell
U22 U23 U27-U29 U33-U35 U38 U39 = LTC4361HTS8-2#TRMPBF: IC OVERVOLT PROT CONT TSOT23-8; Manufacturer: Linear Technology; Manufacturer Part Number: LTC4361ITS8-2#TRMPBF; Current - Supply: 220µA; Voltage - Supply: 2.5 V ~ 80 V; Supplier 1: Digi-Key; RoHS: RoHS Compliant; Category: Integrated Circuits (ICs); Stock 1: 1487; Pricing 1: 1=3.87, 25=3.4596, 100=2.2889, 250=2.09816 (USD); Packaging: Cut Tape (CT); Part Status: Active; Applications: Handheld/Mobile Devices; Operating Temperature: -40°C ~ 85°C; Mounting Type: Surface Mount; Package / Case: SOT-23-8 Thin, TSOT-23-8; Supplier Device Package: TSOT-23-8; Base Part Number: LTC4361-2; ComponentLink1URL: http://www.linear.com/docs/29266; ComponentLink1Description: http://www.linear.com/docs/29266; Supplier Part Number 1: LTC4361ITS8-2#TRMPBFCT-ND

## Nets that join several sheets
GND: Sheet1 (83 pins), Sheet2 (51 pins), Sheet3 (29 pins)
3V3_COM: Sheet1 (R10.2 U2.2 U2.4), Sheet3 (R95.3 U23.3 U23.5)
+5V_BUS: Sheet2 (J9.2), Sheet3 (54 pins)
BATT_+: Sheet1 (12 pins), Sheet2 (6 pins)
V_COM: Sheet1 (U7.15), Sheet2 (R65.1 R72.1)